# Altium schematic sheet 5-ADC.SCHDOC
size A4
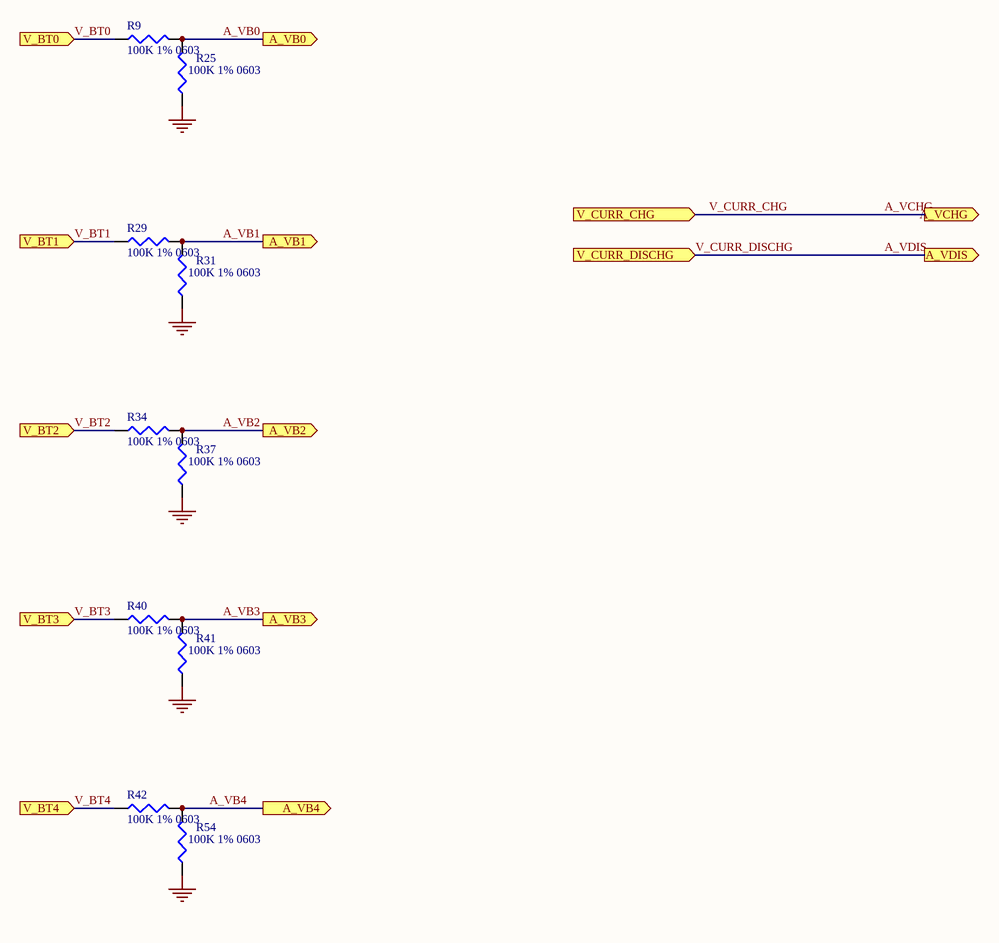
[diagram p0: 5-ADC.SCHDOC]

## Parts
R9  value 100K 1% 0603  [C1608-0603]  (hidden comment: 1K_5%_0603)
R25  value 100K 1% 0603  [C1608-0603]  (hidden comment: 1K_5%_0603)
R29  value 100K 1% 0603  [C1608-0603]  (hidden comment: 1K_5%_0603)
R31  value 100K 1% 0603  [C1608-0603]  (hidden comment: 1K_5%_0603)
R34  value 100K 1% 0603  [C1608-0603]  (hidden comment: 1K_5%_0603)
R37  value 100K 1% 0603  [C1608-0603]  (hidden comment: 1K_5%_0603)
R40  value 100K 1% 0603  [C1608-0603]  (hidden comment: 1K_5%_0603)
R41  value 100K 1% 0603  [C1608-0603]  (hidden comment: 1K_5%_0603)
R42  value 100K 1% 0603  [C1608-0603]  (hidden comment: 1K_5%_0603)
R54  value 100K 1% 0603  [C1608-0603]  (hidden comment: 1K_5%_0603)

## Ports
A_VB0 (out), A_VB1 (out), A_VB2 (out), A_VB3 (out), A_VB4 (out), A_VCHG (out), A_VDIS (out), V_BT0 (in), V_BT1 (in), V_BT2 (in), V_BT3 (in), V_BT4 (in), V_CURR_CHG (in), V_CURR_DISCHG (in)

## Nets
GND: R25.1 R31.1 R37.1 R41.1 R54.1
A_VB0: R9.2 R25.2 ; port A_VB0
A_VB1: R29.2 R31.2 ; port A_VB1
A_VB2: R34.2 R37.2 ; port A_VB2
A_VB3: R40.2 R41.2 ; port A_VB3
A_VB4: R42.2 R54.2 ; port A_VB4
A_VCHG: port A_VCHG, port V_CURR_CHG  [also labelled V_CURR_CHG]
A_VDIS: port A_VDIS, port V_CURR_DISCHG  [also labelled V_CURR_DISCHG]
V_BT0: R9.1 ; port V_BT0
V_BT1: R29.1 ; port V_BT1
V_BT2: R34.1 ; port V_BT2
V_BT3: R40.1 ; port V_BT3
V_BT4: R42.1 ; port V_BT4

## Library data of the parts
R9 R25 R29 R31 R34 R37 R40-R42 R54 = Res3: Resistor; Published: 8-Jun-2000; Revision: July-2002: Re-released for DXP Platform.; Publisher: Altium Limited